# Altium project nRF52840-kit.PrjPcb
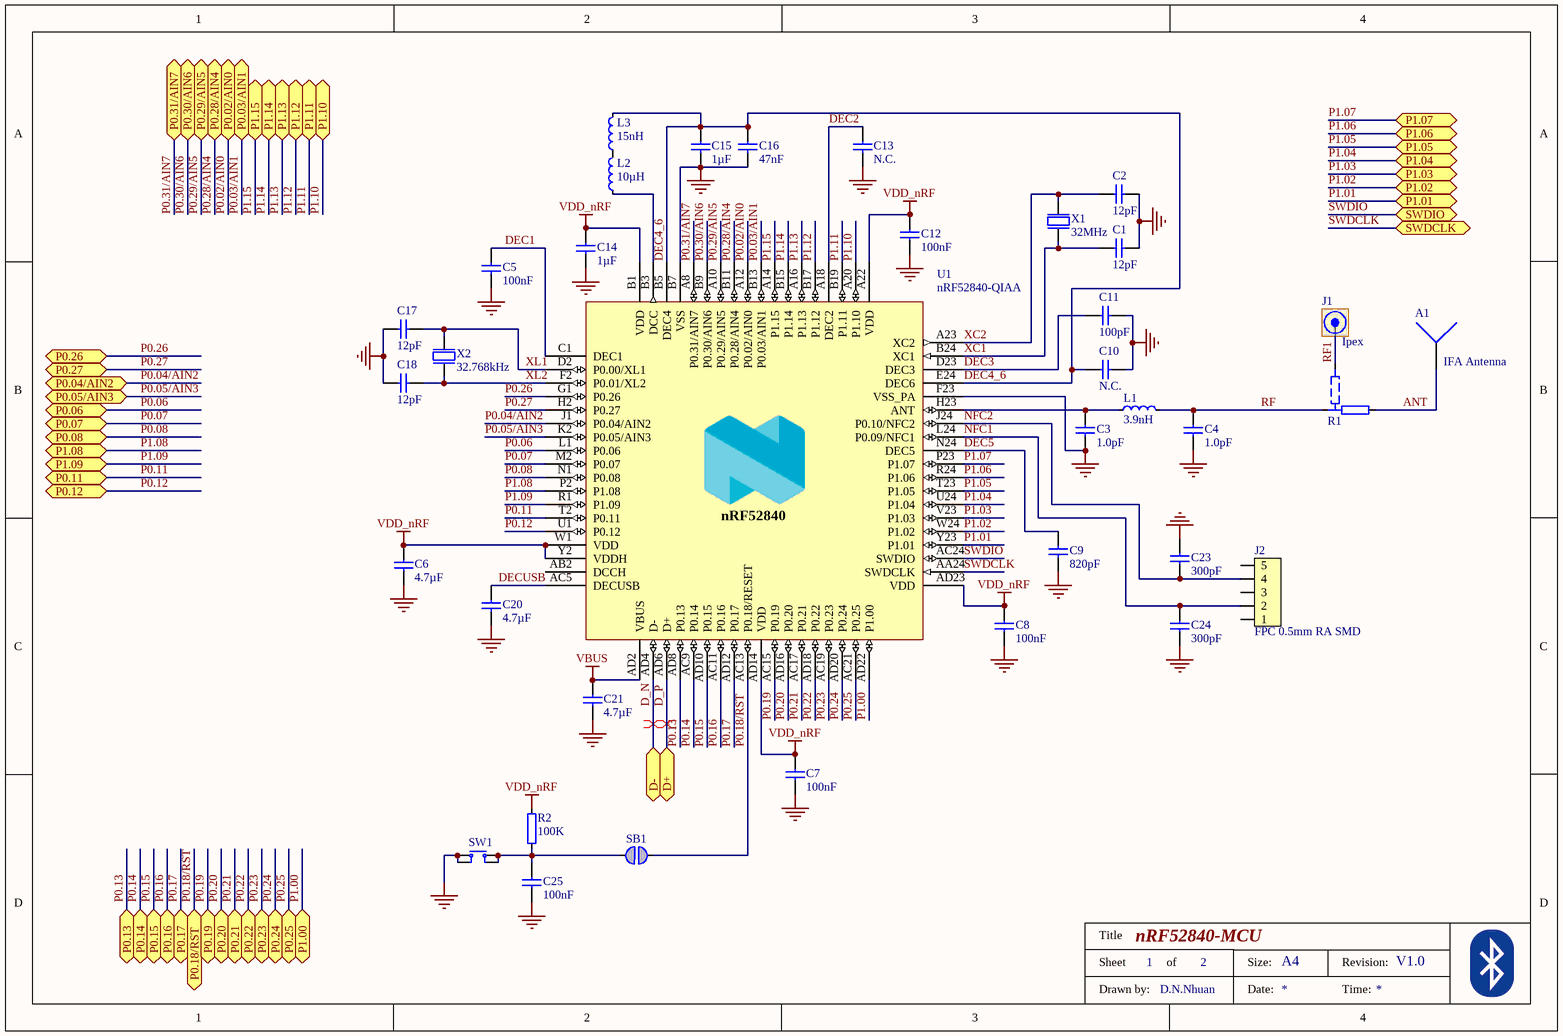
[diagram p0: nRF52840-MCU.SchDoc]
2 sheets, 63 parts. Net scope: flat (ports and power ports of the same name join across sheets).
Board files: nRF52840-kit.PcbDoc, PCB1.PcbDoc
Sheets:
  nRF52840-MCU.SchDoc
  misc.SchDoc

## Sheet nRF52840-MCU.SchDoc: nRF52840-MCU
size A4; DrawnBy: D.N.Nhuan; Revision: V1.0; SheetNumber: 1; SheetTotal: 2

### Parts
A1  IFA Antenna  [IFA_ANTENNA]
C1  12pF  [0402 imperial]
C2  12pF  [0402 imperial]
C3  1.0pF  [0402 imperial]
C4  1.0pF  [0402 imperial]
C5  100nF  [0402 imperial]
C6  4.7µF  [0603_Imperial]
C7  100nF  [0402 imperial]
C8  100nF  [0402 imperial]
C9  820pF  [0402 imperial]
C10  N.C.  [0402 imperial]
C11  100pF  [0402 imperial]
C12  100nF  [0402 imperial]
C13  N.C.  [0402 imperial]
C14  1µF  [0603_Imperial]
C15  1µF  [0603_Imperial]
C16  47nF  [0402 imperial]
C17  12pF  [0402 imperial]
C18  12pF  [0402 imperial]
C20  4.7µF  [0603_Imperial]
C21  4.7µF  [0603_Imperial]
C23  300pF  [0402 imperial]
C24  300pF  [0402 imperial]
C25  100nF  [0402 imperial]
J1  Ipex  [HRS_U.FL-R-SMT]
J2  FPC 0.5mm RA SMD  [FPC_05P-0.5mm-RA-SMD]
L1  3.9nH  [0402 imperial]
L2  10µH  [0603_Imperial]
L3  15nH  [0402 imperial]
R1  Res Selector  [RES_SELECTOR_0402]  (value not drawn)
R2  100K  [0402 imperial]
SB1  Solderbridge  [Solderbridge]  (value not drawn)  (no BOM)
SW1  PB SW  [Switch-PB-6.2x6.3mm-SMD]  (value not drawn)
U1  nRF52840-QIAA  [AQFN50P700X700X85_HS-74N]
X1  32MHz  [XTAL_2016]
X2  32.768kHz  [XTAL_3215]

### Ports
D+, D-, P0.02/AIN0, P0.03/AIN1, P0.04/AIN2, P0.05/AIN3, P0.06, P0.07, P0.08, P0.11, P0.12, P0.13, P0.14, P0.15, P0.16, P0.17, P0.18/RST, P0.19, P0.20, P0.21, P0.22, P0.23, P0.24, P0.25, P0.26, P0.27, P0.28/AIN4, P0.29/AIN5, P0.30/AIN6, P0.31/AIN7, P1.00, P1.01, P1.02, P1.03, P1.04, P1.05, P1.06, P1.07, P1.08, P1.09, P1.10, P1.11, P1.12, P1.13, P1.14, P1.15, SWDCLK, SWDIO

### Nets
GND: A1.2 C1.2 C2.2 C3.1 C4.1 C5.1 C6.1 C7.1 C8.1 C9.1 C10.2 C11.2 C12.1 C13.1 C14.1 C15.1 C16.1 C17.1 C18.1 C20.1 C21.1 C23.2 C24.1 C25.1 J1.1(GND) J1.2(GND) SW1.1(N.O) SW1.3(N.O) U1.74(GND) U1.B7(VSS) U1.F23(VSS_PA) X1.2(GND) X1.4(GND)
VBUS: C21.2 U1.AD2(VBUS)
VDD_nRF: C6.2 C7.2 C8.2 C12.2 C14.2 R2.2 U1.A22(VDD) U1.AD14(VDD) U1.AD23(VDD) U1.B1(VDD) U1.W1(VDD) U1.Y2(VDDH)
ANT: A1.1 R1.2
D_N: U1.AD4(D-) ; port D-
D_P: U1.AD6(D+) ; port D+
DEC1: C5.2 U1.C1(DEC1)
DEC2: C13.2 U1.A18(DEC2)
DEC3: C11.1 U1.D23(DEC3)
DEC4_6: C10.1 C15.2 C16.2 L3.2 U1.B5(DEC4) U1.E24(DEC6)
DEC5: C9.2 U1.N24(DEC5)
DECUSB: C20.2 U1.AC5(DECUSB)
NFC1: C24.2 J2.2 U1.L24(P0.09/NFC1)
NFC2: C23.1 J2.4 U1.J24(P0.10/NFC2)
P0.02/AIN0: U1.A12(P0.02/AIN0) ; port P0.02/AIN0
P0.03/AIN1: U1.B13(P0.03/AIN1) ; port P0.03/AIN1
P0.04/AIN2: U1.J1(P0.04/AIN2) ; port P0.04/AIN2
P0.05/AIN3: U1.K2(P0.05/AIN3) ; port P0.05/AIN3
P0.06: U1.L1(P0.06) ; port P0.06
P0.07: U1.M2(P0.07) ; port P0.07
P0.08: U1.N1(P0.08) ; port P0.08
P0.11: U1.T2(P0.11) ; port P0.11
P0.12: U1.U1(P0.12) ; port P0.12
P0.13: U1.AD8(P0.13) ; port P0.13
P0.14: U1.AC9(P0.14) ; port P0.14
P0.15: U1.AD10(P0.15) ; port P0.15
P0.16: U1.AC11(P0.16) ; port P0.16
P0.17: U1.AD12(P0.17) ; port P0.17
P0.18/RST: SB1.1 U1.AC13(P0.18/RESET) ; port P0.18/RST
P0.19: U1.AC15(P0.19) ; port P0.19
P0.20: U1.AD16(P0.20) ; port P0.20
P0.21: U1.AC17(P0.21) ; port P0.21
P0.22: U1.AD18(P0.22) ; port P0.22
P0.23: U1.AC19(P0.23) ; port P0.23
P0.24: U1.AD20(P0.24) ; port P0.24
P0.25: U1.AC21(P0.25) ; port P0.25
P0.26: U1.G1(P0.26) ; port P0.26
P0.27: U1.H2(P0.27) ; port P0.27
P0.28/AIN4: U1.B11(P0.28/AIN4) ; port P0.28/AIN4
P0.29/AIN5: U1.A10(P0.29/AIN5) ; port P0.29/AIN5
P0.30/AIN6: U1.B9(P0.30/AIN6) ; port P0.30/AIN6
P0.31/AIN7: U1.A8(P0.31/AIN7) ; port P0.31/AIN7
P1.00: U1.AD22(P1.00) ; port P1.00
P1.01: U1.Y23(P1.01) ; port P1.01
P1.02: U1.W24(P1.02) ; port P1.02
P1.03: U1.V23(P1.03) ; port P1.03
P1.04: U1.U24(P1.04) ; port P1.04
P1.05: U1.T23(P1.05) ; port P1.05
P1.06: U1.R24(P1.06) ; port P1.06
P1.07: U1.P23(P1.07) ; port P1.07
P1.08: U1.P2(P1.08) ; port P1.08
P1.09: U1.R1(P1.09) ; port P1.09
P1.10: U1.A20(P1.10) ; port P1.10
P1.11: U1.B19(P1.11) ; port P1.11
P1.12: U1.B17(P1.12) ; port P1.12
P1.13: U1.A16(P1.13) ; port P1.13
P1.14: U1.B15(P1.14) ; port P1.14
P1.15: U1.A14(P1.15) ; port P1.15
RF: C4.2 L1.2 R1.1
RF1: J1.3(SIG) R1.3
SWDCLK: U1.AA24(SWDCLK) ; port SWDCLK
SWDIO: U1.AC24(SWDIO) ; port SWDIO
XC1: C1.1 U1.B24(XC1) X1.1(inp)
XC2: C2.1 U1.A23(XC2) X1.3(out)
XL1: C17.2 U1.D2(P0.00/XL1) X2.2(out)
XL2: C18.2 U1.F2(P0.01/XL2) X2.1(inp)
NetC3_2: C3.2 L1.1 U1.H23(ANT)
NetC25_2: C25.2 R2.1 SB1.2 SW1.2(COM) SW1.4(COM)
NetL2_1: L2.1 U1.B3(DCC)
NetL2_2: L2.2 L3.1

Not connected (* = marked no-connect by the designer): J2 1 3 5; U1 AB2(DCCH)

### Layout directives
differential pair: D_N, D_P

### Notes on the sheet
- Title
- Sheet
- of
- Size:
- A4
- Revision:
- Drawn by:
- Date:
- Time:
- (in symbol nRF52840_QIAA) nRF52840

### Library data of the parts
A1 = IFA Antenna: Texas Instrument
C1-C18 C20 C21 C23-C25 = Capacitor: common library; Tolerance: ±5%; Link of Supplier: *; Manufacturer: *; Manufacturer Part Number: *; Voltage Rating: *
  C1 C2 C17 C18: Value: 12pF
  C3 C4: Value: 1.0pF
  C5 C7 C8 C12 C25: Value: 100nF
  C6 C20 C21: Value: 4.7µF
  C9: Value: 820pF
  C10 C13: Value: N.C.
  C11: Value: 100pF
  C14 C15: Value: 1µF
  C16: Value: 47nF
  C23 C24: Value: 300pF
J1 = IPEX connector: Hirose; MP: U.FL-R-SMT_01_; Note: Ipex; MF: Hirose
J2 = FPC_05P-0.5mm-RA-SMD: 0.5mm FPC, 5P,Right Angle SMT,Double Contact,H=1.2mm,White, Tin plated; Manufacturer: W-CON; Manufacturer Part Number: 5141-05RZDNWR01; 2nd source part number: WM9836CT-ND; Part number IPS: 00000007792; Artikkelnr Noca: 55010020; Artikkelnr Simpro: N.A.; Part Number: FPC_05P-0.5mm-RA-SMD; Datasheet: \\hizz\pro\app9717\Datasheet\connectores\W-CON\5141-XXRZDNXX0X.pdf; Footprint Doc: FPC_05P-0.5mm-RA-SMD; LatestRevisionDate: 2016-04-21; Pin Count: 7; Publisher: Nordic Semiconductor; Published: 2015-06-22; Value: FPC 0.5mm RA SMD; Note: *; Supplier: Cabcon; Supplier part number: 5141-05RZDNWR01; 2nd source Supplier: Digi-Key
L1-L3 = Inductor: common library; Supplier: *; Link of Supplier: *; Maximum Current: *; Footprint: 0402
  L1: Value: 3.9nH
  L2: Value: 10µH
  L3: Value: 15nH
R1 = Res_Selector: Value: 0R; Name: Res Selector
R2 = Resistor: common library; Tolerance: ±5%; Value: 100K; Link of Supplier: *; Power Rating: *
SB1 = Solderbridge: Artikkelnr Noca: N.A.; Part Number: Solderbridge; Manufacturer: *; Manufacturer Part Number: *; Datasheet: *; LatestRevisionDate: 2009-12-14; Pin Count: 2; Publisher: Nordic Semiconductor; Published: 2009-12-14; Value: Solderbridge; Note: *; Supplier: *; Supplier part number: *; 2nd source Supplier: *; 2nd source part number: *; Footprint Doc: Solderbridge; Artikkelnr Simpro: N.A.
SW1 = Push-Button: 4-pin; Manufacturer: *; Manufacturer Part Number: *; Pin Count: 4; Value: PB SW; Note: *; Part Number: *
U1 = nRF52840_QIAA: Multi-protocol Bluetooth Low Energy, IEEE 802.15.4, ANT and 2.4GHz proprietary system-on-chip; Part Number: nRF52840-QIAAC0; Manufacturer: Nordic Semiconductor; Artikkelnr Noca: N.A.; Manufacturer Part Number: nRF52840-QIAAC0; LatestRevisionDate: 2017-12-06; Pin Count: 73; Publisher: Nordic Semiconductor; Published: 2017-08-21; Value: nRF52840-QIAA; Note: *; Supplier: Nordic Semiconductor; Supplier part number: nRF52840-QIAAC0; 2nd source Supplier: *; 2nd source part number: *; Footprint Doc: AQFN-73; Artikkelnr Simpro: N.A.; Part number IPS: N.A.; ComponentLink1URL: *; ComponentLink1Description: Datasheet; ComponentLink2URL: *; ComponentLink2Description: Supplier link; HelpURL: *
X1 = XTAL: 4-pin; Value: 32MHz
X2 = XTAL_1: 2-pin; Value: 32.768kHz

## Sheet misc.SchDoc: Miscellaneous
size A4; DrawnBy: D.N.Nhuan; Revision: v1.0; SheetNumber: 2; SheetTotal: 2
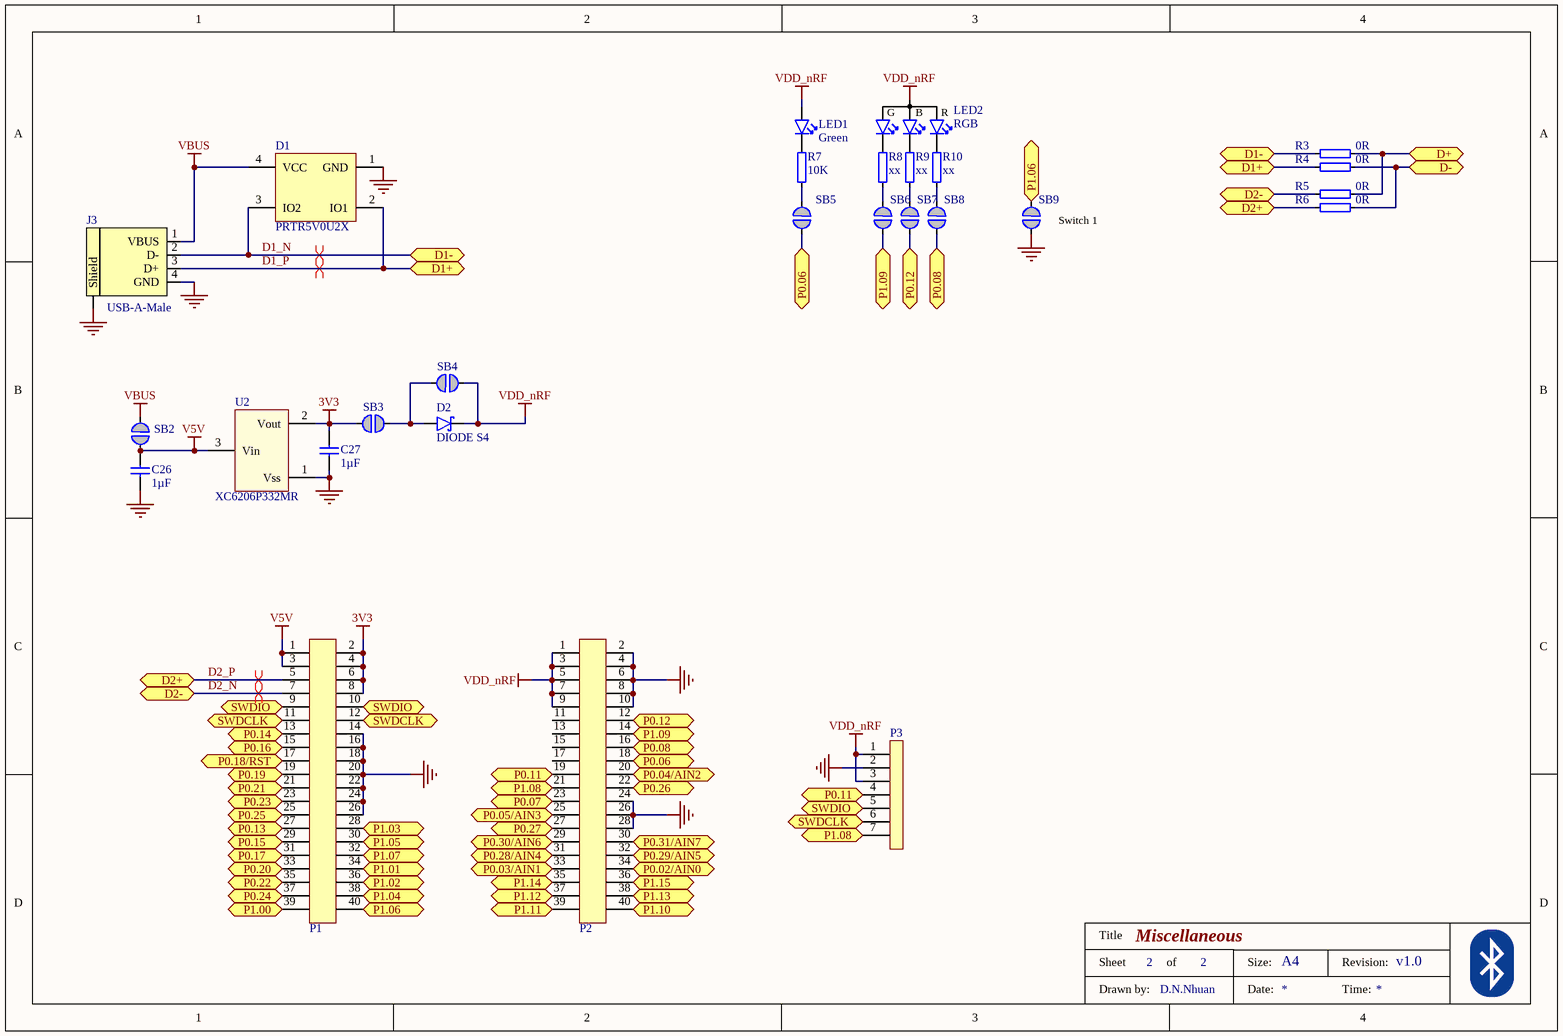
[diagram p1: misc.SchDoc]

### Parts
C26  1µF  [0603_Imperial]
C27  1µF  [0603_Imperial]
D1  PRTR5V0U2X  [SOT190P230X110-4L]
D2  DIODE S4  [SOD-123]
J3  USB-A-Male  [USB-A-DIP]
LED1  Green  [LED_0603]
LED2  RGB  [LED_0603_RGB]
P1  *  [CONN1.27MM2x20_FM_SMD]  (value not drawn)
P2  *  [CONN1.27MM2x20_FM_SMD]  (value not drawn)
P3  7p, 2.54mm  [CONN2.54MM7P]  (value not drawn)
R3  0R  [0402 imperial]
R4  0R  [0402 imperial]
R5  0R  [0402 imperial]
R6  0R  [0402 imperial]
R7  10K  [0402 imperial]
R8  xx  [0402 imperial]
R9  xx  [0402 imperial]
R10  xx  [0402 imperial]
SB2  Solderbridge  [Solderbridge]  (value not drawn)  (no BOM)
SB3  Solderbridge  [Solderbridge]  (value not drawn)  (no BOM)
SB4  Solderbridge  [Solderbridge]  (value not drawn)  (no BOM)
SB5  Solderbridge  [Solderbridge]  (value not drawn)  (no BOM)
SB6  Solderbridge  [Solderbridge]  (value not drawn)  (no BOM)
SB7  Solderbridge  [Solderbridge]  (value not drawn)  (no BOM)
SB8  Solderbridge  [Solderbridge]  (value not drawn)  (no BOM)
SB9  Solderbridge  [Solderbridge]  (value not drawn)  (no BOM)
U2  XC6206P332MR  [SOT-23]

### Ports
D1+, D1-, D2+, D2-, D+, D-, P0.02/AIN0, P0.03/AIN1, P0.04/AIN2, P0.05/AIN3, P0.06, P0.07, P0.08, P0.11, P0.12, P0.13, P0.14, P0.15, P0.16, P0.17, P0.18/RST, P0.19, P0.20, P0.21, P0.22, P0.23, P0.24, P0.25, P0.26, P0.27, P0.28/AIN4, P0.29/AIN5, P0.30/AIN6, P0.31/AIN7, P1.00, P1.01, P1.02, P1.03, P1.04, P1.05, P1.06, P1.07, P1.08, P1.09, P1.10, P1.11, P1.12, P1.13, P1.14, P1.15, SWDCLK, SWDIO

### Nets
3V3: C27.2 P1.2 P1.4 P1.6 P1.8 SB3.2 U2.2(Vout)
GND: C26.1 C27.1 D1.1(GND) J3.4(GND) J3.5(Shield) P1.14 P1.16 P1.18 P1.20 P1.22 P1.24 P1.26 P2.2 P2.4 P2.6 P2.8 P2.10 P2.24 P2.26 P2.28 P3.2 SB9.2 U2.1(Vss)
V5V: C26.2 P1.1 P1.3 SB2.2 U2.3(Vin)
VBUS: D1.4(VCC) J3.1(VBUS) SB2.1
VDD_nRF: D2.1(C) LED1.2(A) LED2.2(A) P2.1 P2.3 P2.5 P2.7 P2.9 P3.1 P3.3 SB4.1
D1_N: D1.3(IO2) J3.2(D-) R3.1 ; port D1-
D1_P: D1.2(IO1) J3.3(D+) R4.1 ; port D1+
D2_N: P1.7 R5.1 ; port D2-
D2_P: P1.5 R6.1 ; port D2+
D_N: R4.2 R6.2 ; port D-
D_P: R3.2 R5.2 ; port D+
P0.02/AIN0: P2.34 ; port P0.02/AIN0
P0.03/AIN1: P2.33 ; port P0.03/AIN1
P0.04/AIN2: P2.20 ; port P0.04/AIN2
P0.05/AIN3: P2.25 ; port P0.05/AIN3
P0.06: P2.18 SB5.2 ; port P0.06
P0.07: P2.23 ; port P0.07
P0.08: P2.16 SB8.2 ; port P0.08
P0.11: P2.19 P3.4 ; port P0.11
P0.12: P2.12 SB7.2 ; port P0.12
P0.13: P1.27 ; port P0.13
P0.14: P1.13 ; port P0.14
P0.15: P1.29 ; port P0.15
P0.16: P1.15 ; port P0.16
P0.17: P1.31 ; port P0.17
P0.18/RST: P1.17 ; port P0.18/RST
P0.19: P1.19 ; port P0.19
P0.20: P1.33 ; port P0.20
P0.21: P1.21 ; port P0.21
P0.22: P1.35 ; port P0.22
P0.23: P1.23 ; port P0.23
P0.24: P1.37 ; port P0.24
P0.25: P1.25 ; port P0.25
P0.26: P2.22 ; port P0.26
P0.27: P2.27 ; port P0.27
P0.28/AIN4: P2.31 ; port P0.28/AIN4
P0.29/AIN5: P2.32 ; port P0.29/AIN5
P0.30/AIN6: P2.29 ; port P0.30/AIN6
P0.31/AIN7: P2.30 ; port P0.31/AIN7
P1.00: P1.39 ; port P1.00
P1.01: P1.34 ; port P1.01
P1.02: P1.36 ; port P1.02
P1.03: P1.28 ; port P1.03
P1.04: P1.38 ; port P1.04
P1.05: P1.30 ; port P1.05
P1.06: P1.40 SB9.1 ; port P1.06
P1.07: P1.32 ; port P1.07
P1.08: P2.21 P3.7 ; port P1.08
P1.09: P2.14 SB6.2 ; port P1.09
P1.10: P2.40 ; port P1.10
P1.11: P2.39 ; port P1.11
P1.12: P2.37 ; port P1.12
P1.13: P2.38 ; port P1.13
P1.14: P2.35 ; port P1.14
P1.15: P2.36 ; port P1.15
SWDCLK: P1.11 P1.12 P3.6 ; port SWDCLK
SWDIO: P1.9 P1.10 P3.5 ; port SWDIO
NetD2_2: D2.2(A) SB3.1 SB4.2
NetLED1_1: LED1.1(C) R7.2
NetLED2_1: LED2.1(R) R10.2
NetLED2_3: LED2.3(B) R9.2
NetLED2_4: LED2.4(G) R8.2
NetR7_1: R7.1 SB5.1
NetR8_1: R8.1 SB6.1
NetR9_1: R9.1 SB7.1
NetR10_1: R10.1 SB8.1

Not connected (* = marked no-connect by the designer): P2 11 13 15 17

### Layout directives
differential pair: D1_N, D1_P, D2_N, D2_P

### Notes on the sheet
- (near SB9) Switch 1
- Title
- Sheet
- of
- Size:
- A4
- Revision:
- Drawn by:
- Date:
- Time:

### Library data of the parts
C26 C27 = Capacitor: common library; Tolerance: ±5%; Value: 1µF; Link of Supplier: *; Manufacturer: *; Manufacturer Part Number: *; Voltage Rating: *
D1 = PRTR5V0U2X: Ultra low capacitance double rail-to-rail ESD protection diode; Manufacturer: NXP; 2nd source part number: 152-4157; Artikkelnr Noca: 10069015; Artikkelnr Simpro: N.A.; Part Number: PRTR5V0U2X; Manufacturer Part Number: PRTR5V0U2X; Datasheet: http://www.farnell.com/datasheets/109718.pdf; LatestRevisionDate: 2012-06-11; Publisher: Nordic Semiconductor; Published: 2012-06-11; Value: PRTR5V0U2X; Note: *; Supplier: Digi-Key; Supplier part number: 568-4140-1-ND; 2nd source Supplier: Farnell; Footprint Doc: SOT-143B
D2 = Diode Schottky: common library; Value: DIODE S4; Note: *
LED1 = LED: common library; Color: Green; Footprint: 0603
LED2 = LED_RGB: Type: RGB; Supplier: thegioiic
P1 P2 = Header 20x2: Value: *
P3 = Header 7: Value: 7p, 2.54mm
R3-R10 = Resistor: common library; Tolerance: ±5%; Link of Supplier: *; Power Rating: *
  R3-R6: Value: 0R
  R7: Value: 10K
  R8-R10: Value: xx
SB2-SB9 = Solderbridge: Artikkelnr Noca: N.A.; Part Number: Solderbridge; Manufacturer: *; Manufacturer Part Number: *; Datasheet: *; LatestRevisionDate: 2009-12-14; Pin Count: 2; Publisher: Nordic Semiconductor; Published: 2009-12-14; Value: Solderbridge; Note: *; Supplier: *; Supplier part number: *; 2nd source Supplier: *; 2nd source part number: *; Footprint Doc: Solderbridge; Artikkelnr Simpro: N.A.
U2 = XC6206: Low ESR Cap.Compatible Positive Voltage Regulators; Type: XC6206P332MR
J3 = USB-A-Male: Supplier: https://banlinhkien.vn/goods-938-usb-a-duc-smd-usb-a-s01.html; Using reference: https://hshop.vn/products/mach-chuyen-usb-uart-cp2102

## Nets that join several sheets
GND: nRF52840-MCU (33 pins), misc (23 pins)
VBUS: nRF52840-MCU (C21.2 U1.AD2), misc (D1.4 J3.1 SB2.1)
VDD_nRF: nRF52840-MCU (12 pins), misc (11 pins)
D_N: nRF52840-MCU (U1.AD4), misc (R4.2 R6.2)
D_P: nRF52840-MCU (U1.AD6), misc (R3.2 R5.2)
P0.02/AIN0: nRF52840-MCU (U1.A12), misc (P2.34)
P0.03/AIN1: nRF52840-MCU (U1.B13), misc (P2.33)
P0.04/AIN2: nRF52840-MCU (U1.J1), misc (P2.20)
P0.05/AIN3: nRF52840-MCU (U1.K2), misc (P2.25)
P0.06: nRF52840-MCU (U1.L1), misc (P2.18 SB5.2)
P0.07: nRF52840-MCU (U1.M2), misc (P2.23)
P0.08: nRF52840-MCU (U1.N1), misc (P2.16 SB8.2)
P0.11: nRF52840-MCU (U1.T2), misc (P2.19 P3.4)
P0.12: nRF52840-MCU (U1.U1), misc (P2.12 SB7.2)
P0.13: nRF52840-MCU (U1.AD8), misc (P1.27)
P0.14: nRF52840-MCU (U1.AC9), misc (P1.13)
P0.15: nRF52840-MCU (U1.AD10), misc (P1.29)
P0.16: nRF52840-MCU (U1.AC11), misc (P1.15)
P0.17: nRF52840-MCU (U1.AD12), misc (P1.31)
P0.18/RST: nRF52840-MCU (SB1.1 U1.AC13), misc (P1.17)
P0.19: nRF52840-MCU (U1.AC15), misc (P1.19)
P0.20: nRF52840-MCU (U1.AD16), misc (P1.33)
P0.21: nRF52840-MCU (U1.AC17), misc (P1.21)
P0.22: nRF52840-MCU (U1.AD18), misc (P1.35)
P0.23: nRF52840-MCU (U1.AC19), misc (P1.23)
P0.24: nRF52840-MCU (U1.AD20), misc (P1.37)
P0.25: nRF52840-MCU (U1.AC21), misc (P1.25)
P0.26: nRF52840-MCU (U1.G1), misc (P2.22)
P0.27: nRF52840-MCU (U1.H2), misc (P2.27)
P0.28/AIN4: nRF52840-MCU (U1.B11), misc (P2.31)
P0.29/AIN5: nRF52840-MCU (U1.A10), misc (P2.32)
P0.30/AIN6: nRF52840-MCU (U1.B9), misc (P2.29)
P0.31/AIN7: nRF52840-MCU (U1.A8), misc (P2.30)
P1.00: nRF52840-MCU (U1.AD22), misc (P1.39)
P1.01: nRF52840-MCU (U1.Y23), misc (P1.34)
P1.02: nRF52840-MCU (U1.W24), misc (P1.36)
P1.03: nRF52840-MCU (U1.V23), misc (P1.28)
P1.04: nRF52840-MCU (U1.U24), misc (P1.38)
P1.05: nRF52840-MCU (U1.T23), misc (P1.30)
P1.06: nRF52840-MCU (U1.R24), misc (P1.40 SB9.1)
P1.07: nRF52840-MCU (U1.P23), misc (P1.32)
P1.08: nRF52840-MCU (U1.P2), misc (P2.21 P3.7)
P1.09: nRF52840-MCU (U1.R1), misc (P2.14 SB6.2)
P1.10: nRF52840-MCU (U1.A20), misc (P2.40)
P1.11: nRF52840-MCU (U1.B19), misc (P2.39)
P1.12: nRF52840-MCU (U1.B17), misc (P2.37)
P1.13: nRF52840-MCU (U1.A16), misc (P2.38)
P1.14: nRF52840-MCU (U1.B15), misc (P2.35)
P1.15: nRF52840-MCU (U1.A14), misc (P2.36)
SWDCLK: nRF52840-MCU (U1.AA24), misc (P1.11 P1.12 P3.6)
SWDIO: nRF52840-MCU (U1.AC24), misc (P1.9 P1.10 P3.5)